# Altium schematic sheet FPGA-OSC-JTAG.SchDoc
size A4; SheetNumber: 5; SheetTotal: 5
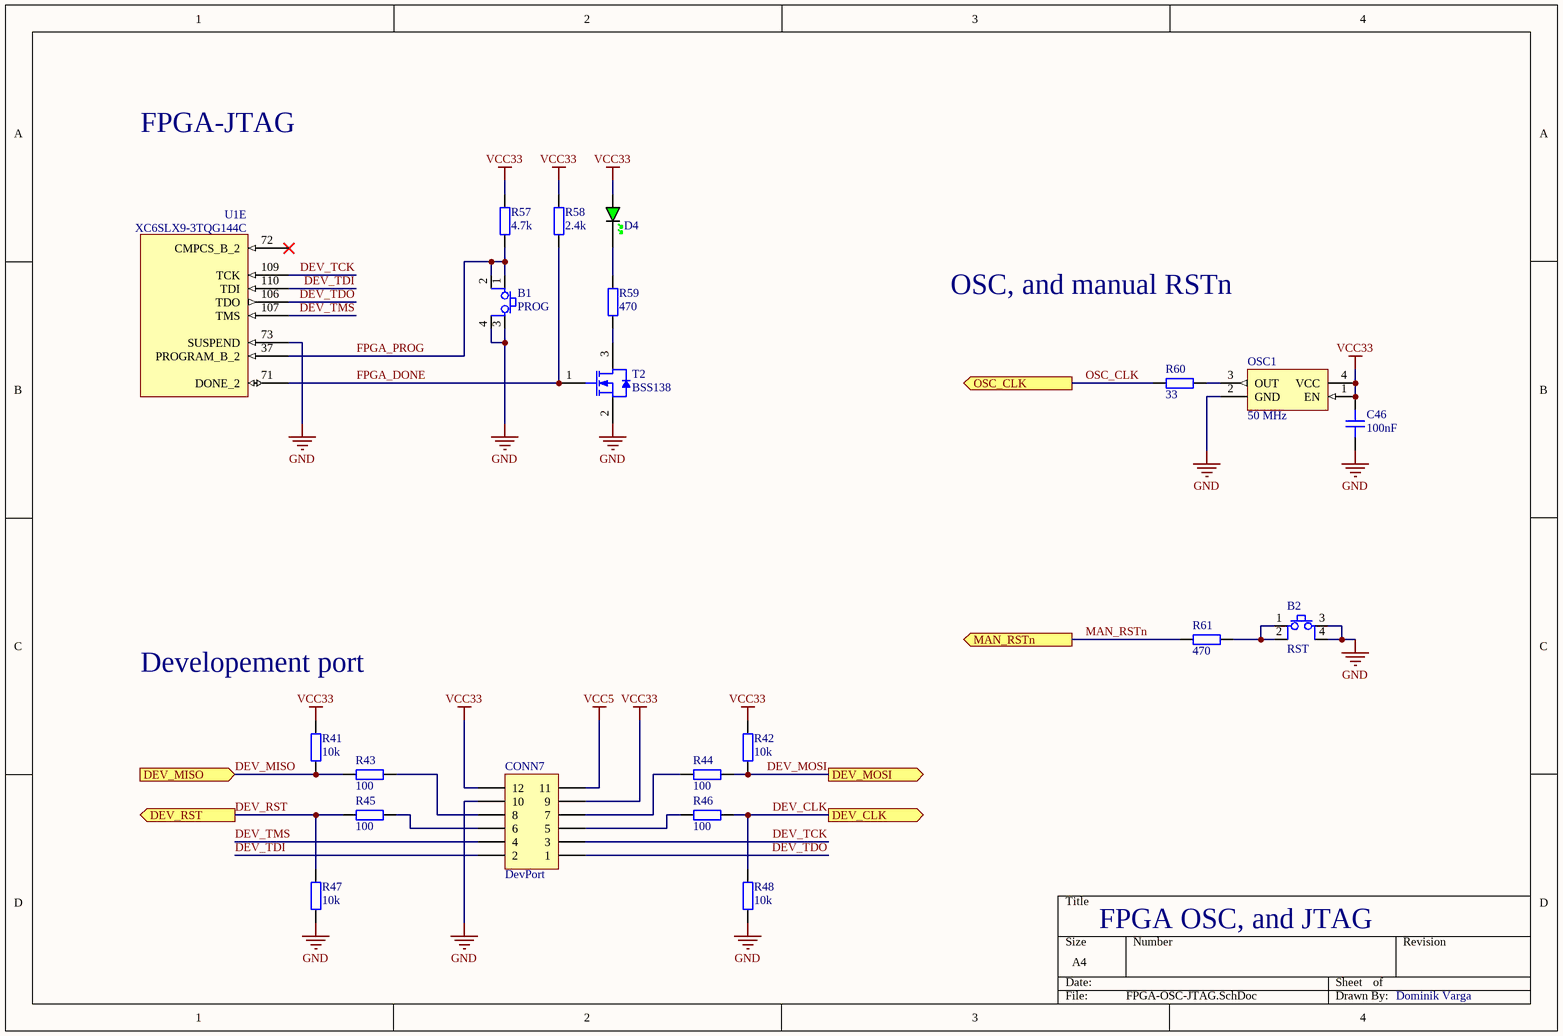
[diagram p0: FPGA-OSC-JTAG.SchDoc]

## Parts
B1  PROG  [SMD_Button]
B2  RST  [SMD_Button]
C46  100nF  [CAP_SMD0603]
CONN7  DevPort  [HDR2X6]
D4  GREEN  [LED_G_SMD0603]  (value not drawn)
OSC1  50 MHz  [OSCSC508P500X700X200-4N]
R41  10k  [RES_SMD0603]
R42  10k  [RES_SMD0603]
R43  100  [RES_SMD0603]
R44  100  [RES_SMD0603]
R45  100  [RES_SMD0603]
R46  100  [RES_SMD0603]
R47  10k  [RES_SMD0603]
R48  10k  [RES_SMD0603]
R57  4.7k  [RES_SMD0603]
R58  2.4k  [RES_SMD0603]
R59  470  [RES_SMD0603]
R60  33  [RES_SMD0603]
R61  470  [RES_SMD0603]
T2  BSS138  [SOT95P240X110-3N]
U1  XC6SLX9-3TQG144C  [QFP50P2200X2200X160-144N]  (part E of 7)

## Ports
DEV_CLK (out, see FPGA-IO-BANKS[2C]), DEV_MISO (in, see FPGA-IO-BANKS[2A]), DEV_MOSI (out, see FPGA-IO-BANKS[2C]), DEV_RST (out, see FPGA-IO-BANKS[2C]), MAN_RSTn (out, see FPGA-IO-BANKS[2D]), OSC_CLK (out, see FPGA-IO-BANKS[2D])

## Nets
GND: B1.3 B1.4 B2.3 B2.4 C46.1 CONN7.10 OSC1.2(GND) R47.2 R48.2 T2.2(S) U1.73(SUSPEND)
VCC5: CONN7.11
VCC33: C46.2 CONN7.9 CONN7.12 D4.1(A) OSC1.1(EN) OSC1.4(VCC) R41.1 R42.1 R57.2 R58.2
DEV_CLK: R46.2 R48.1 ; port DEV_CLK
DEV_MISO: R41.2 R43.1 ; port DEV_MISO
DEV_MOSI: R42.2 R44.2 ; port DEV_MOSI
DEV_RST: R45.1 R47.1 ; port DEV_RST
DEV_TCK: CONN7.3 U1.109(TCK)
DEV_TDI: CONN7.2 U1.110(TDI)
DEV_TDO: CONN7.1 U1.106(TDO)
DEV_TMS: CONN7.4 U1.107(TMS)
FPGA_DONE: R58.1 T2.1(G) U1.71(DONE_2)
FPGA_PROG: B1.1 B1.2 R57.1 U1.37(PROGRAM_B_2)
MAN_RSTn: R61.2 ; port MAN_RSTn
OSC_CLK: R60.2 ; port OSC_CLK
NetB2_1: B2.1 B2.2 R61.1
NetCONN7_5: CONN7.5 R46.1
NetCONN7_6: CONN7.6 R45.2
NetCONN7_7: CONN7.7 R44.1
NetCONN7_8: CONN7.8 R43.2
NetD4_2: D4.2(K) R59.2
NetOSC1_3: OSC1.3(OUT) R60.1
NetR59_1: R59.1 T2.3(D)

Not connected (* = marked no-connect by the designer): U1 72(CMPCS_B_2)*

## Notes on the sheet
- FPGA-JTAG
- OSC, and manual RSTn
- Developement port
- FPGA OSC, and JTAG
- Dominik Varga

## Library data of the parts
B1 B2 = TS-1109S-C-A: Basic SMD button; Manufacturer: XKB Connectivity; Manufacturer Part Number: TS-1109S-C-A; Datasheet: https://datasheet.lcsc.com/lcsc/2110151730_XKB-Connectivity-TS-1109S-C-A_C397346.pdf
C46 = CAP_0603: Capacitor SMD 0603
CONN7 = DevPort: Header, 6-Pin, Dual row; LatestRevisionDate: 17-Jul-2002; LatestRevisionNote: Re-released for DXP Platform.; Publisher: Altium Limited
D4 = LED_0603_GREEN: LED 0603 GREEN SMD
R41-R48 R57-R61 = RES_0603: Resistor SMD 0603
T2 = BSS138: N-Channel Enhancement Mode Field-Effect Transistor; Manufacturer: NXP Semiconductors; PartNumber: SI2302DS,215; Ciss [typ] (pF): 230; VDS [max] (V): 20; Channel Type: N; Coss [typ] (pF): 125; ID [max] (A): 2.5; Packing: Tape & Reel; DatasheetVersion: Rev. 02; PackageVersion: 06-03-16, 03/2006; Code_JEDEC: TO-236AB; ComponentLink3Description: Package Specification; ComponentLink2URL: http://www.nxp.com/documents/data_sheet/SI2302DS.pdf; PackageDescription: 3-Pin Small Outline Transistor Package, Body 2.9 x 1.3 mm, Pitch 0.95 mm; ComponentLink2Description: Datasheet; ComponentLink1Description: Manufacturer URL; Mounting Technology: Surface Mount; ComponentLink1URL: http://www.nxp.com/; ComponentLink3URL: http://www.nxp.com/documents/outline_drawing/sot023_po.pdf; PackageReference: SOT23
U1 = XC6SLX9-3TQG144C: Spartan-6 LX 1.2V FPGA, 102 User I/Os, 144-Pin TQFP (0.5mm Pitch), Speed Grade 3, Industrial Grade, Pb-Free